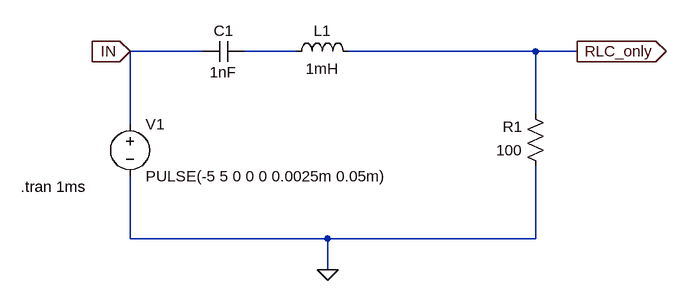
[diagram p0: schematic RLC_only.asc]
RLC_only.asc, the LTspice schematic file:
Version 4
SHEET 1 1428 680
WIRE -256 144 -368 144
WIRE -112 144 -192 144
WIRE 256 144 -32 144
WIRE 320 144 256 144
WIRE 256 240 256 144
WIRE -368 256 -368 144
WIRE -368 432 -368 336
WIRE -64 432 -368 432
WIRE 256 432 256 320
WIRE 256 432 -64 432
WIRE -64 480 -64 432
FLAG -64 480 0
FLAG 320 144 RLC_only
IOPIN 320 144 Out
FLAG -368 144 IN
IOPIN -368 144 In
SYMBOL ind -128 160 R270
WINDOW 0 32 56 VTop 2
WINDOW 3 5 56 VBottom 2
SYMATTR InstName L1
SYMATTR Value 1mH
SYMBOL cap -192 128 R90
WINDOW 0 0 32 VBottom 2
WINDOW 3 32 32 VTop 2
SYMATTR InstName C1
SYMATTR Value 1nF
SYMBOL voltage -368 240 R0
WINDOW 123 0 0 Left 0
WINDOW 39 0 0 Left 0
SYMATTR InstName V1
SYMATTR Value PULSE(-5 5 0 0 0 0.0025m 0.05m)
SYMBOL res 272 336 R180
WINDOW 0 36 76 Left 2
WINDOW 3 36 40 Left 2
SYMATTR InstName R1
SYMATTR Value 100
TEXT -536 352 Left 2 !.tran 1ms

The netlist it stands for:
* RLC_only.asc
L1 N001 RLC_only 1mH
C1 N001 IN 1nF
V1 IN 0 PULSE(-5 5 0 0 0 0.0025m 0.05m)
R1 0 RLC_only 100
.tran 1ms
.backanno
.end